# EAGLE design ACE (EAGLE 9.6.2)
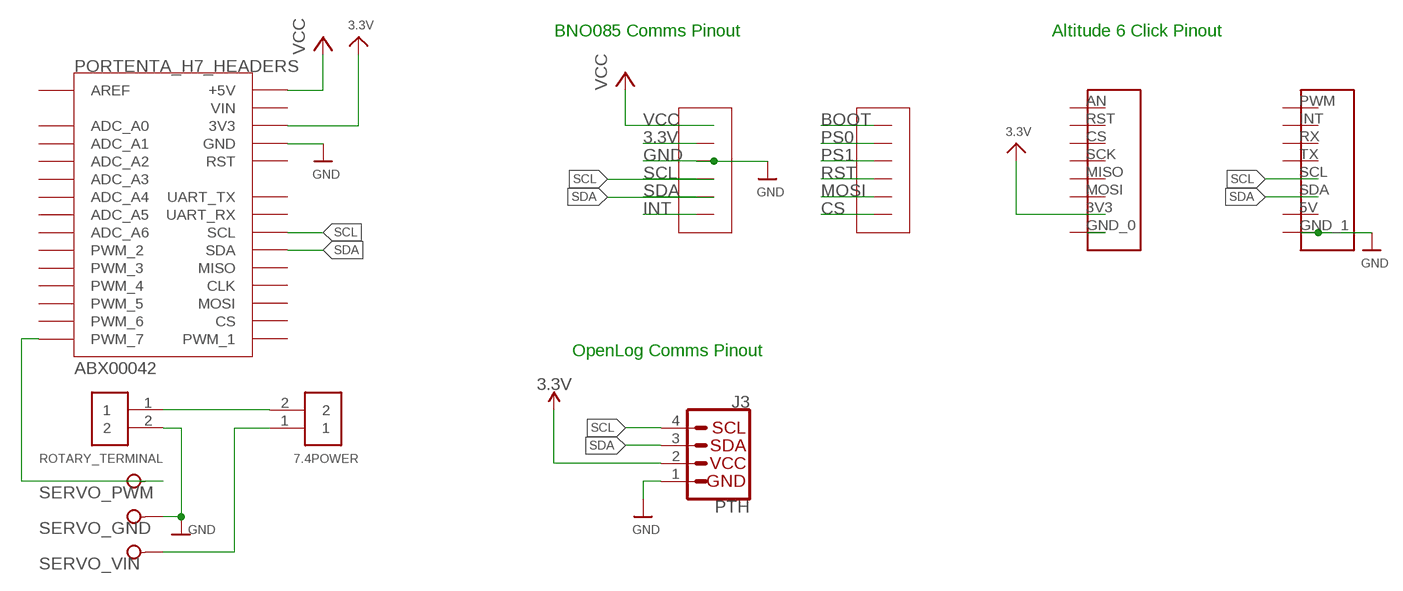
[diagram p0: schematic, sheet 1]

## Parts
7.4POWER  282837-2  [TE_282837-2]
J3  PTH  I2C_STANDARD_NO_SILK  [1X04_NO_SILK]
ROTARY_TERMINAL  282837-2  [TE_282837-2]
SERVO  W237-3E  [W237-3E]
U$1  MIKROE-ALTITUDE-6-CLICK-DVC  [MIKROE-ALTITUDE-6-CLICK-PINOUT]
U$5  ADAFRUIT_BNO08X  [ADAFRUIT_BNO08X_FOOTPRINT]
U$10  ABX00042_HEADERS_IO  [MODULE_ABX00042_HEADERS]

## Nets
3.3V [lowpower]: J3.2(VCC) U$1.3V3(3.3V) U$10.J17(3V3)
GND [lowpower]: J3.1(GND) ROTARY_TERMINAL.2 SERVO.2 U$1.GND_1 U$5.GND U$10.J18(GND)
N$4 [lowpower]: U$1.GND_0
SCL: J3.4(SCL) U$1.SCL U$5.SCL U$10.J22(SCL)
SDA: J3.3(SDA) U$1.SDA U$5.SDA U$10.J23(SDA)
SERVO_GND: 7.4POWER.2 ROTARY_TERMINAL.1
SERVO_PWM: SERVO.1 U$10.J9(PWM_7)
SERVO_VIN: 7.4POWER.1 SERVO.3
VCC [lowpower]: U$5.VIN(VCC) U$10.J15(+5V)
Unconnected: U$1.5V U$1.AN U$1.CS U$1.INT U$1.MISO U$1.MOSI U$1.PWM U$1.RST U$1.RX U$1.SCK U$1.TX U$5.3VO(3.3V) U$5.BT(BOOT) U$5.CS U$5.DI(MOSI) U$5.INT U$5.P0(PS0) U$5.P1(PS1) U$5.RST U$10.J1(AREF) U$10.J2(ADC_A0) U$10.J3(ADC_A1) U$10.J4(ADC_A2) U$10.J5(ADC_A3) U$10.J6(ADC_A4) U$10.J7(ADC_A5) U$10.J8(ADC_A6) U$10.J10(PWM_6) U$10.J11(PWM_5) U$10.J12(PWM_4) U$10.J13(PWM_3) U$10.J14(PWM_2) U$10.J16(VIN) U$10.J19(RST) U$10.J20(UART_TX) U$10.J21(UART_RX) U$10.J24(MISO) U$10.J25(CLK) U$10.J26(MOSI) U$10.J27(CS) U$10.J28(PWM_1)

## Notes on the sheet
- BNO085 Comms Pinout | Altitude 6 Click Pinout
- OpenLog Comms Pinout

## Library data of the parts
7.4POWER ROTARY_TERMINAL = 282837-2:282837-2: TERM BLOCK 5.08MM 2POS SIDE ENTY Check availability <https://pricing.snapeda.com/parts/282837-2/TE%20Connectivity/view-part?ref=eda>; AVAILABILITY: In Stock; CHECK_PRICES: https://www.snapeda.com/parts/282837-2/TE+Connectivity+AMP+Connectors/view-part/?ref=eda; COMMENT: 282837-2; DESCRIPTION: Terminal Block Connector Wire Receptacle 2 5.08 mm 30-16 AWG Green 13.5 A 250 V | TE Connectivity 282837-2; MF: TE Connectivity; MP: 282837-2; PACKAGE: None; PRICE: None; PURCHASE-URL: https://www.snapeda.com/api/url_track_click_mouser/?unipart_id=2549980&manufacturer=TE Connectivity&part_name=282837-2&search_term=None; SNAPEDA_LINK: https://www.snapeda.com/parts/282837-2/TE+Connectivity+AMP+Connectors/view-part/?ref=snap
J3 = SparkX:I2C_STANDARD: SparkFun I2C Standard Pinout Header SparkFun has standardized on a pinout for all I2C based sensor breakouts. This pinout allows I2C boards to be plugged directly into the headers on Arduino Uno compatible boards, and to be daisy chained easily. Example SparkFun Products: SparkFun Atmospheric Sensor Breakout - BME280 <https://www.sparkfun.com/products/13676> SparkFun Altitude/Pressure Sensor Breakout - MPL3115A2 <https://www.sparkfun.com/products/11084> SparkFun TOF Range Finder Sensor - VL6180 <https://www.sparkfun.com/products/12785>
SERVO = con-wago-508:W237-3E: WAGO SREW CLAMP; OC_FARNELL: unknown; OC_NEWARK: unknown
U$1 = MIKROE-4903:MIKROE-ALTITUDE-6-CLICK-DVC: Device for the Mikroe Altitude 6 Click device
U$5 = ADAFRUIT_BNO08x:ADAFRUIT_BNO08X: Adafruit BNO08x Device
U$10 = ABX00042:ABX00042_HEADERS_IO: Device for Portenta H7 pin headers IO

## Net classes
1 vcc: width 0.152 mm
2 lowpower: width 0.254 mm, drill 0.381 mm

## Board
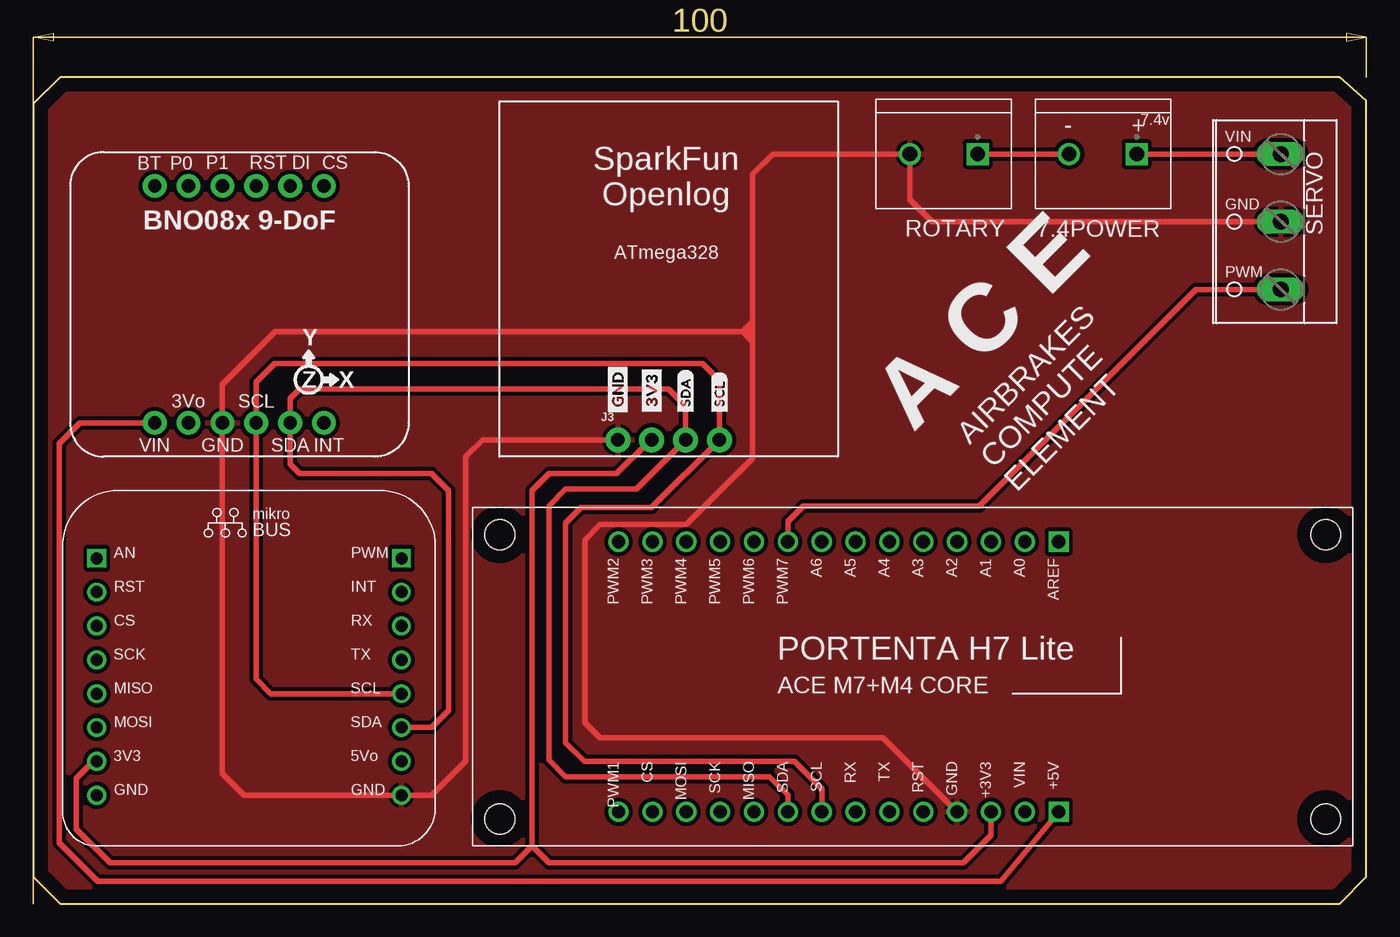
[diagram p1: board, top side]
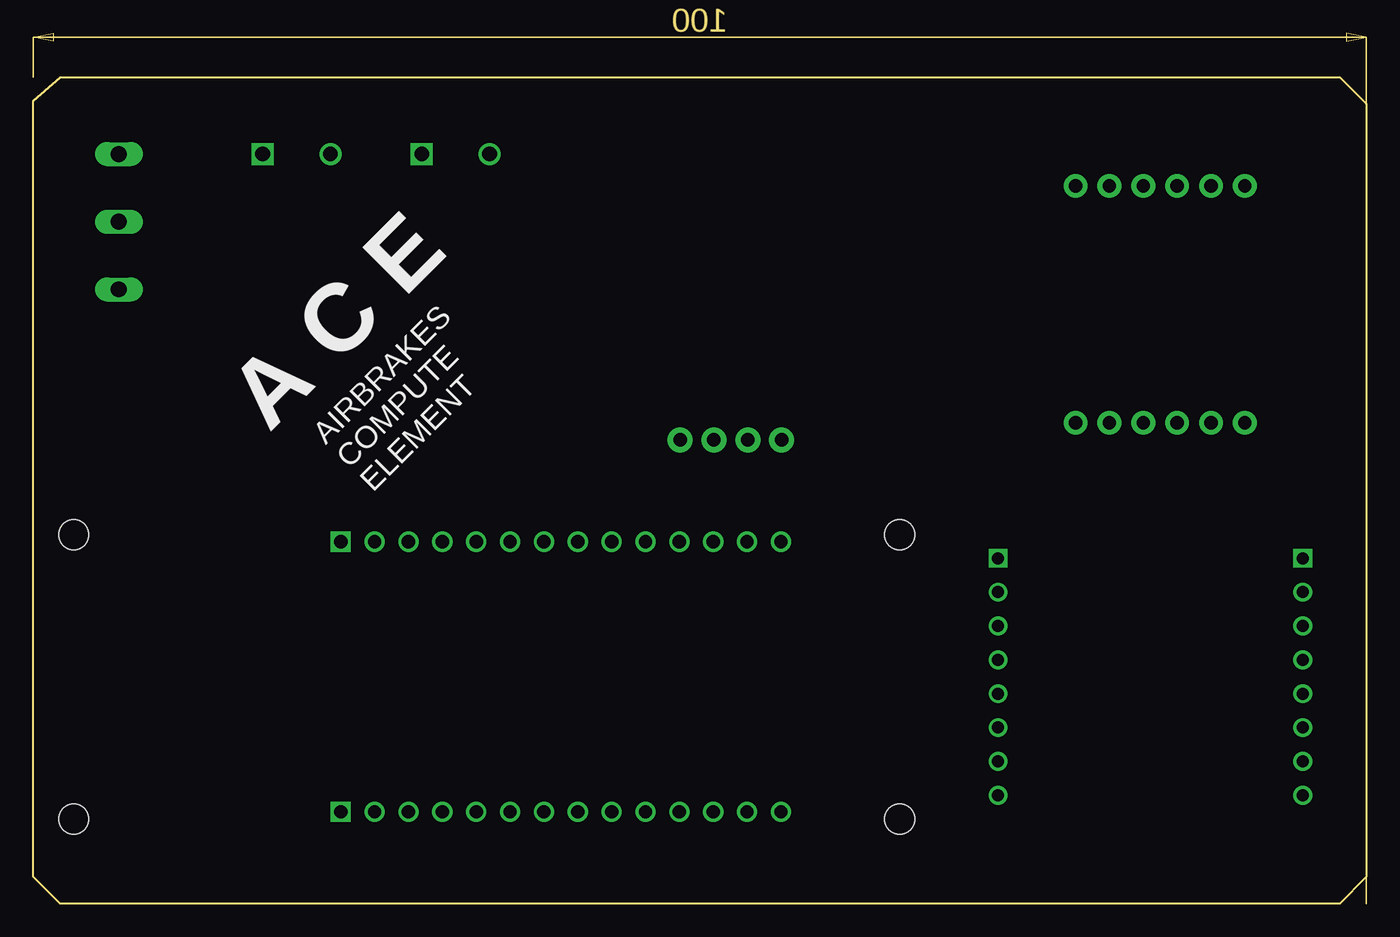
[diagram p2: board, bottom side, seen from below]

Size 100 x 62 mm. Coordinates in mm from the lower left corner, seen from the top.
Outline: 98,62 2,62 0,60 0,2 2,0 98,0 100,2 100,60.25 98,62
Copper layers (1*16): Top 0.035mm / dielectric 1.5mm / Bottom 0.035mm
Design rules "default *": minimum track width 6mil, minimum drill 0.35mm, track to track 6mil, track to pad 6mil, pad to pad 6mil, via to via 6mil, smd to smd 6mil, copper to edge 40mil, drill to drill 8mil, minimum pad ring 10mil, minimum via ring 8mil, stop-mask expansion 4mil, vias tented up to drill 0mil, thermal gap 10mil

### Footprints (pad centres in the part's own frame; a part is rotated, then mirrored left to right if it is on the bottom)
TE_282837-2 = drill 1.1 square: 1 -2.54,0 | drill 1.1: 2 2.54,0
1X04_NO_SILK = drill 1.016 pad 1.88: 1 0,0; 2 2.54,0; 3 5.08,0; 4 7.62,0
W237-3E = drill 1.194 long: 1 -5.08,-0.635; 2 0,-0.635; 3 5.08,-0.635
MIKROE-ALTITUDE-6-CLICK-PINOUT = drill 0.9: 3V3 2.54,7.62; 5V 25.4,7.62; CS 2.54,17.78; GND_0 2.54,5.08; GND_1 25.4,5.08; INT 25.4,20.32; MISO 2.54,12.7; MOSI 2.54,10.16; RST 2.54,20.32; RX 25.4,17.78; SCK 2.54,15.24; SCL 25.4,12.7; SDA 25.4,10.16; TX 25.4,15.24 | drill 0.9 square: AN 2.54,22.86; PWM 25.4,22.86
ADAFRUIT_BNO08X_FOOTPRINT = drill 1 pad 1.778: 3VO 10.16,3.81; BT 7.62,21.59; CS 20.32,21.59; DI 17.78,21.59; GND 12.7,3.81; INT 20.32,3.81; P0 10.16,21.59; P1 12.7,21.59; RST 15.24,21.59; SCL 15.24,3.81; SDA 17.78,3.81; VIN 7.62,3.81
MODULE_ABX00042_HEADERS = drill 1 square: J1 -10.135,10.947; J15 10.135,10.947 | drill 1: J2 -10.135,8.407; J3 -10.135,5.867; J4 -10.135,3.327; J5 -10.135,0.787; J6 -10.135,-1.753; J7 -10.135,-4.293; J8 -10.135,-6.833; J9 -10.135,-9.373; J10 -10.135,-11.913; J11 -10.135,-14.453; J12 -10.135,-16.993; J13 -10.135,-19.533; J14 -10.135,-22.073; J16 10.135,8.407; J17 10.135,5.867; J18 10.135,3.327; J19 10.135,0.787; J20 10.135,-1.753; J21 10.135,-4.293; J22 10.135,-6.833; J23 10.135,-9.373; J24 10.135,-11.913; J25 10.135,-14.453; J26 10.135,-16.993; J27 10.135,-19.533; J28 10.135,-22.073 | hole 2.25: -10.67,30.99; 10.67,30.99; 10.67,-30.99; -10.67,-30.99

### Placement (x,y rotation side)
7.4POWER  80.25,56.25 180 top
J3  43.85,34.8 0 top
ROTARY_TERMINAL  68.31,56.25 180 top
SERVO  92.95,51.17 90 top
U$1  2.21,3.05 0 top
U$5  1.48,32.26 0 top
U$8  [3V3-03]  46.39,36.45 90 top
U$9  [GND-03]  43.85,36.45 90 top
U$10  65.98,17.02 270 top
U$16  [SDA1]  48.93,36.57 90 top
U$19  [SCL2]  51.47,36.57 90 top

### Tracks (layer width: path | path; a pad name or v marks a point on that pad's centre or on a via)
3.3V
  Top 0.406: U$10.J17 71.85,5.1 69.79,3.05 38.68,3.05 37.41,4.32 | J3.2 46.3,34.8 43.76,32.26 38.68,32.26 37.41,30.99 37.41,4.32 | 37.41,4.32 36.14,3.05 5.75,3.05 3.21,5.59 3.21,9.4 4.48,10.67 U$1.3V3
GND
  Top 0.406: J3.1 33.69,34.8 32.42,33.53 32.42,10.67 29.88,8.13 U$1.GND_1 15.82,8.13 14.18,9.76 U$5.GND 14.18,38.95 18.15,42.91 53.2,42.91 | U$10.J18 63.76,12.43 42.53,12.43 41.39,13.57 41.39,27.29 42.53,28.43 49.01,28.43 53.96,33.39 53.96,42.15 | 53.96,42.15 53.96,42.53 | 53.96,42.53 53.96,42.91 | 53.96,42.91 53.96,43.29 | 53.96,43.29 53.96,43.67 | 53.96,43.67 53.96,54.72 55.49,56.25 ROTARY_TERMINAL.2 65.77,52.82 67.42,51.17 SERVO.2 | 53.2,42.91 53.58,42.91 | 53.58,42.91 53.96,42.91 | 53.96,42.53 53.58,42.91 | 53.58,42.91 53.96,43.29 | 53.2,42.91 53.96,43.67 | 53.96,42.15 53.2,42.91
  pour Top (isolate 0.305): -0.14,62.22 -0.14,-0.01 100.19,-0.01 100.19,62.22
SCL
  Top 0.406: U$10.J22 59.15,8.61 57.09,10.67 41.35,10.67 39.95,12.06 39.95,28.57 41.09,29.72 46.39,29.72 J3.4 51.47,39.24 50.2,40.51 18.09,40.51 16.72,39.15 U$5.SCL 16.72,16.84 17.82,15.75 U$1.SCL
SDA
  Top 0.406: U$10.J23 56.61,8.15 55.24,9.52 39.95,9.52 38.68,10.79 38.68,29.84 39.95,31.11 45.25,31.11 J3.3 48.93,37.34 47.66,38.61 19.99,38.61 19.26,37.88 U$5.SDA 19.26,32.99 19.99,32.26 29.88,32.26 31.15,30.99 31.15,14.48 29.88,13.21 U$1.SDA
SERVO_GND
  Top 0.406: 7.4POWER.2 ROTARY_TERMINAL.1
SERVO_PWM
  Top 0.406: U$10.J9 56.61,28.67 57.77,29.83 70.98,29.83 87.24,46.09 SERVO.1
SERVO_VIN
  Top 0.406: 7.4POWER.1 SERVO.3
VCC
  Top 0.406: U$5.VIN 3.48,36.07 1.94,34.53 1.94,4.57 4.84,1.67 72.59,1.67 U$10.J15

### Text on the board
tPlace: - | + | 7.4v | VIN | SparkFun / Openlog | GND | ROTARY | ATmega328 | PWM | A C E | AIRBRAKES / COMPUTE / ELEMENT
bPlace: A C E | AIRBRAKES / COMPUTE / ELEMENT